# Altium schematic sheet Pump.SchDoc
size A4; SheetNumber: 5; SheetTotal: 11
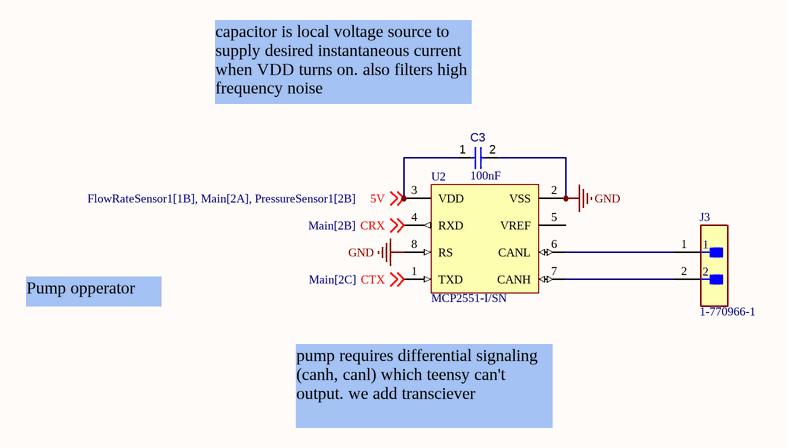
[diagram p0: Pump.SchDoc]

## Parts
C3  value 100nF  [CAPC1005X56X25LL10T15]  (hidden comment: Capacitor 0.1 uF +/- 5% 16 V 0402)
J3  1-770966-1  [FP-1-770966-1-MFG]
U2  MCP2551-I/SN  [MCHP-SN8_V]

## Nets
GND: C3.2 U2.2(VSS) U2.8(RS)
5V: C3.1 U2.3(VDD) ; off-sheet 5V
CRX: U2.4(RXD) ; off-sheet CRX
CTX: U2.1(TXD) ; off-sheet CTX
NetJ3_1: J3.1 U2.6(CANL)
NetJ3_2: J3.2 U2.7(CANH)

Not connected (* = marked no-connect by the designer): U2 5(VREF)

## Notes on the sheet
- capacitor is local voltage source to supply desired instantaneous current when VDD turns on. also filters high frequency noise
- Pump opperator
- pump requires differential signaling (canh, canl) which teensy can't output. we add transciever

## Library data of the parts
C3 = CMP-001-00001-6: Chip Capacitor, 0.1 uF, +/- 5%, 16 V, 0402 (1005 Metric); Capacitor Type: Ceramic; Voltage Rating: 16V; Max Operating Temperature: 125°C; Min Operating Temperature: -55°C; Case/Package: 0402; Mounting Technology: SM; Pins: 2; Tolerance: 5%; RoHS Compliant: True
J3 = CMP-03369-000082-1: CONN HEADER R/A 2POS 4.14MM; Manufacturer: TE; Current Rating: 9.5A; Standoff Height: 0.63mm; Conn Gender: Male; Voltage Rating: 600V; Number Of Contacts: 2; Conn Orientation: Right Angle; Device Class L3: unset; Pitch: 4.14mm; Height: 7.9mm; Temperature Range High: +105°C; Octopart: https://octopart.com/1-770966-1-te+connectivity-46506767; Automotive: No; Digikey Description: CONN HEADER R/A 2POS 4.14MM; ComponentLink2URL: https://www.te.com/usa-en/product-1-770966-1.html?te_bu=Cor&te_type=other&te_campaign=oct_glo_cor-oct-global-oth-prtnr-fy19-oct-octo-buy-bom_sma-298_2&elqCampaignId=35216; Category: Conn; Lead Free: Yes; Mouser Description: Pin & Socket Connectors HEADER 2 POS R/A GOLD IN-LINE; ComponentLink2Description: Datasheet; Contact Material: Gold,Tin,Nickel; Device Class L1: Connectors; Number Of Rows: 1; Device Class L2: Headers and Wire Housings; Package: 1-770966-1; RoHS: TRUE; Manufacturer Part Number: 1-770966-1; Temperature: -55°C to +105°C; Temperature Range Low: -55°C
U2 = CMP-0186-00138-3: High-Speed CAN Transceiver, / 1 Mb/s, 4.5 to 5.5 V, 8-Pin SOIC (SN), Industrial Temperature, RoHS, Tube; Manufacturer: Microchip; RoHSCompliant: true; PackageReference: SN8; ComponentLink1URL: http://www.microchip.com/; DatasheetVersion: Rev. F, 07/2010; ComponentLink2Description: Datasheet; ComponentLink2URL: http://ww1.microchip.com/downloads/en/DeviceDoc/21667f.pdf; ComponentLink3Description: Package Specification; PackageDescription: 8-Pin Small Outline Integrated Circuit, Body 4.9 x 3.9 mm, Pitch 1.27 mm; ComponentLink1Description: Manufacturer URL; Mounting Technology: Surface Mount; ComponentLink3URL: http://www.microchip.com/stellent/groups/techpub_sg/documents/packagingspec/en012702.pdf